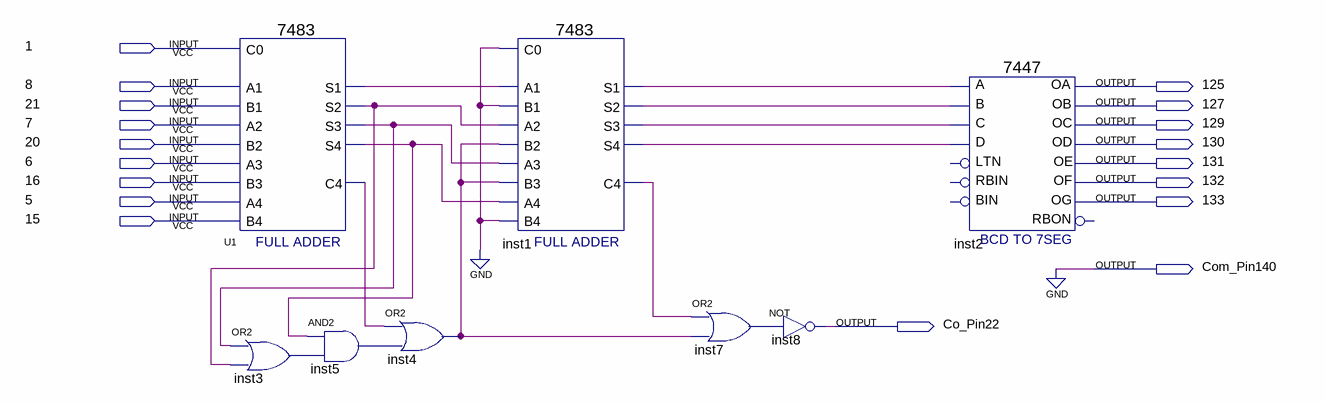
[diagram p0: schematic sheet]
// Quartus schematic 180601_7483_BCD_adder.bdf as structural Verilog: 8 symbols, 18 pins
module \180601_7483_BCD_adder  (
  input  \1 ,
  input  \8 ,
  input  \21 ,
  input  \7 ,
  input  \20 ,
  input  \6 ,
  input  \16 ,
  input  \5 ,
  input  \15 ,
  output \125 ,
  output \127 ,
  output \129 ,
  output \130 ,
  output \131 ,
  output \132 ,
  output \133 ,
  output Com_Pin140,
  output Co_Pin22
);

  wire inst1_c4, inst1_s1, inst1_s2, inst1_s3, inst1_s4, inst3_out, inst4_out, inst5_out, inst7_out, U1_c4,
       U1_s1, U1_s2, U1_s3, U1_s4;

  \7483  U1 (
    .B4(\15 ), .C0(\1 ), .A1(\8 ), .A2(\7 ), .B1(\21 ), .B2(\20 ), .A3(\6 ), .B3(\16 ), .A4(\5 ), .S3(U1_s3),
    .S4(U1_s4), .S2(U1_s2), .C4(U1_c4), .S1(U1_s1));
  or inst3 (inst3_out, U1_s3, U1_s2);
  and inst5 (inst5_out, U1_s4, inst3_out);
  or inst4 (inst4_out, U1_c4, inst5_out);
  \7483  inst1 (
    .B4(1'b0), .C0(1'b0), .A1(U1_s1), .A2(U1_s2), .B1(1'b0), .B2(inst4_out), .A3(U1_s3), .B3(inst4_out),
    .A4(U1_s4), .S3(inst1_s3), .S4(inst1_s4), .S2(inst1_s2), .C4(inst1_c4), .S1(inst1_s1));
  or inst7 (inst7_out, inst1_c4, inst4_out);
  not inst8 (Co_Pin22, inst7_out);
  \7447  inst2 (
    .B(inst1_s2), .C(inst1_s3), .D(inst1_s4), .A(inst1_s1), .OB(\127 ), .OC(\129 ), .OE(\131 ), .OD(\130 ),
    .OF(\132 ), .OG(\133 ), .OA(\125 ));  // open: LTN, RBIN, BIN, RBON

  assign Com_Pin140 = 1'b0;
endmodule
